# Altium project EE209_Prototype_SMT.PrjPcb
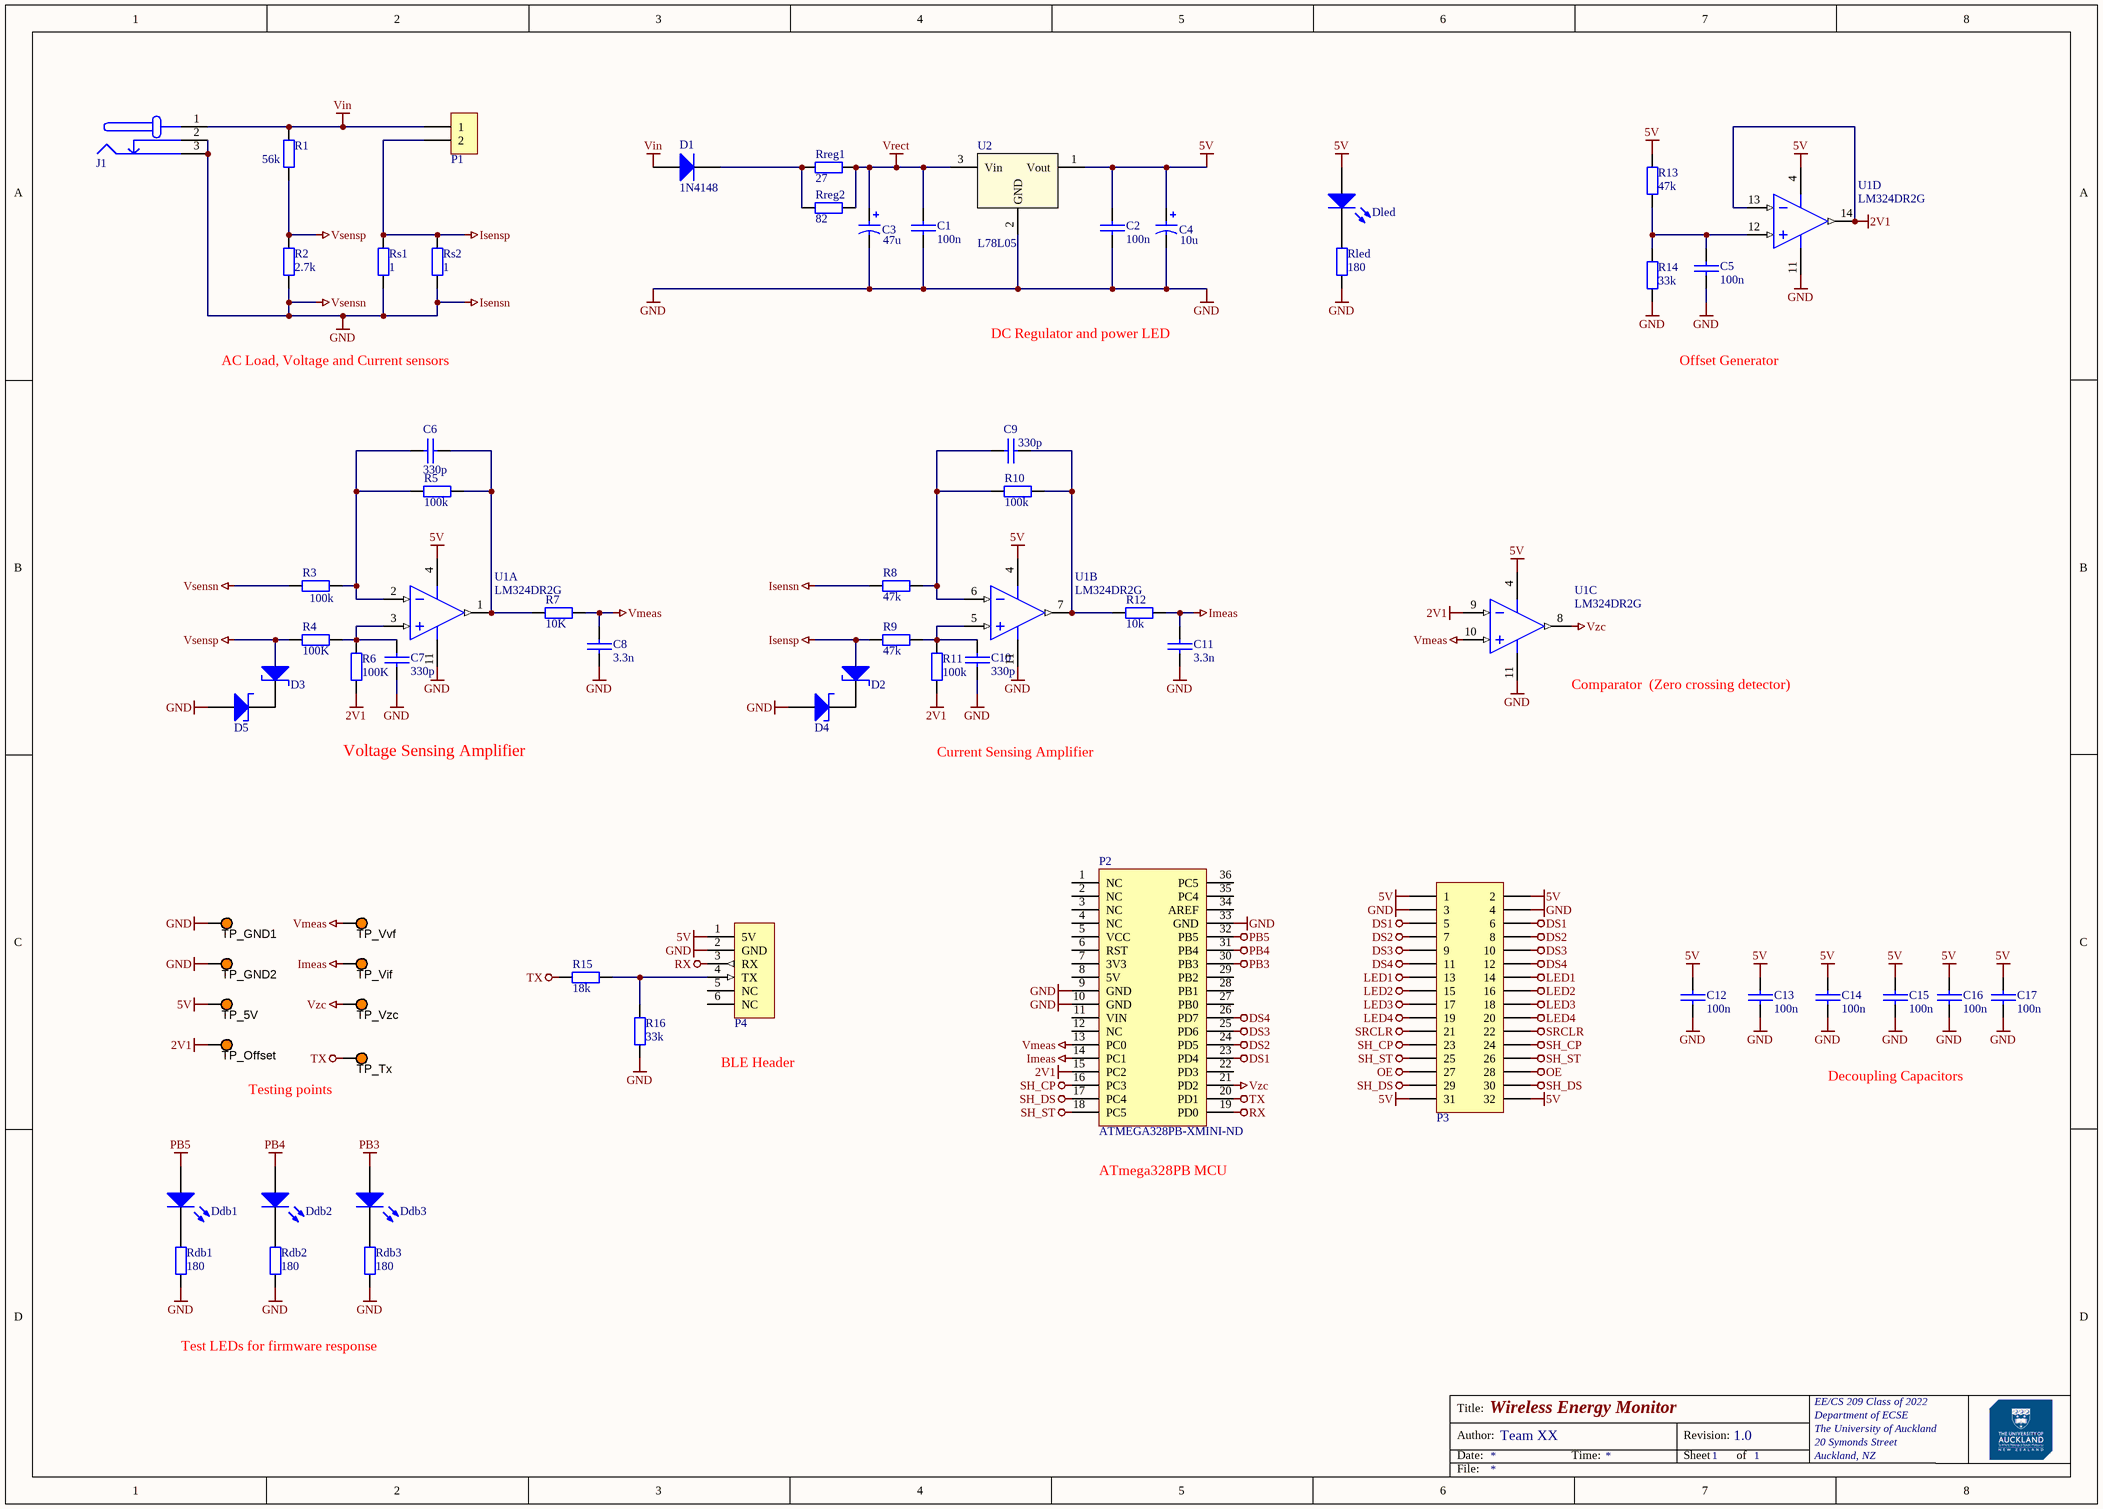
[diagram p0: EE209_Schematic_SMT.SchDoc]
1 sheet, 65 parts. Net scope: global (net labels, ports and power ports of the same name join across sheets).
Board file: SMT_PCB.PcbDoc

## Sheet EE209_Schematic_SMT.SchDoc: Wireless Energy Monitor
size A3; Author: Team XX; Organization: EE/CS 209 Class of 2022; Address1: Department of ECSE; Address2: The University of Auckland; Address3: 20 Symonds Street; Address4: Auckland, NZ; Revision: 1.0; SheetNumber: 1; SheetTotal: 1

### Parts
C1  100n  [0805 CAP]
C2  100n  [0805 CAP]
C3  47u  [CAP POL 8x5.4mm SMT]
C4  10u  [CAP POL 8x5.4mm SMT]
C5  100n  [0805 CAP]
C6  330p  [0805 CAP]
C7  330p  [0805 CAP]
C8  3.3n  [0805 CAP]
C9  330p  [0805 CAP]
C10  330p  [0805 CAP]
C11  3.3n  [0805 CAP]
C12  100n  [0805 CAP]
C13  100n  [0805 CAP]
C14  100n  [0805 CAP]
C15  100n  [0805 CAP]
C16  100n  [0805 CAP]
C17  100n  [0805 CAP]
D1  1N4148  [DO214-MFG]
D2  BZT52H-B4V7  [SOD123]  (value not drawn)
D3  BZT52H-B4V7  [SOD123]  (value not drawn)
D4  BZT52H-B4V7  [SOD123]  (value not drawn)
D5  BZT52H-B4V7  [SOD123]  (value not drawn)
Ddb1  LTST-C170KGKT  [0805 LED]  (value not drawn)
Ddb2  LTST-C170KGKT  [0805 LED]  (value not drawn)
Ddb3  LTST-C170KGKT  [0805 LED]  (value not drawn)
Dled  LTST-C170KGKT  [0805 LED]  (value not drawn)
J1  DC barrel jack  [AC-Socket]  (value not drawn)
P1  Dual Banana Plugs  [Dual Banana Plug]  (value not drawn)
P2  Supplier Part Number 1: ATMEGA328PB-XMINI-ND  [ATmeg328P Xplained]  (hidden comment: ATmega328PB Xplained Mini Header)
P3  Display  [Display]  (value not drawn)
P4  BLE Module Header  [HM10_HDR1X6]  (value not drawn)
R1  value 56k  [0805 RES]
R2  2.7k  [0805 RES]
R3  value 100k  [0805 RES]
R4  100K  [0805 RES]
R5  100k  [0805 RES]
R6  100K  [0805 RES]
R7  10K  [0805 RES]
R8  47k  [0805 RES]
R9  47k  [0805 RES]
R10  100k  [0805 RES]
R11  100k  [0805 RES]
R12  10k  [0805 RES]
R13  47k  [0805 RES]
R14  33k  [0805 RES]
R15  18k  [0805 RES]
R16  33k  [0805 RES]
Rdb1  180  [0805 RES]
Rdb2  180  [0805 RES]
Rdb3  180  [0805 RES]
Rled  180  [0805 RES]
Rreg1  27  [0805 RES]
Rreg2  82  [0805 RES]
Rs1  1  [0805 RES]
Rs2  1  [0805 RES]
TP_5V  5003  [TP_TH]  (value not drawn)
TP_GND1  5003  [TP_TH]  (value not drawn)
TP_GND2  5003  [TP_TH]  (value not drawn)
TP_Offset  5003  [TP_TH]  (value not drawn)
TP_Tx  5003  [TP_TH]  (value not drawn)
TP_Vif  5003  [TP_TH]  (value not drawn)
TP_Vvf  5003  [TP_TH]  (value not drawn)
TP_Vzc  5003  [TP_TH]  (value not drawn)
U1  LM324DR2G  [SOIC-14]  (parts A,B,C,D of 4)
U2  L78L05  [SOT-89]

### Nets
2V1: P2.15(PC2) R6.2 R11.2 TP_Offset.1 U1.9(IN3-) U1.13(IN4-) U1.14(OUT4)
5V: C2.1 C4.1 C12.1 C13.1 C14.1 C15.1 C16.1 C17.1 Dled.1(A) P3.1 P3.2 P3.31 P3.32 P4.1(5V) R13.2 TP_5V.1 U1.4(VCC) U2.1(Vout)
DS1: P2.23(PD4) P3.5 P3.6
DS2: P2.24(PD5) P3.7 P3.8
DS3: P2.25(PD6) P3.9 P3.10
DS4: P2.26(PD7) P3.11 P3.12
GND: C1.2 C2.2 C3.2 C4.2 C5.2 C7.2 C8.2 C10.2 C11.2 C12.2 C13.2 C14.2 C15.2 C16.2 C17.2 D4.1(A) D5.1(A) J1.2(GND_ALT) J1.3(GND) P2.9(GND) P2.10(GND) P2.33(GND) P3.3 P3.4 P4.2(GND) R2.1 R3.1 R8.1 R14.1 R16.1 Rdb1.2 Rdb2.2 Rdb3.2 Rled.1 Rs1.1 Rs2.1 TP_GND1.1 TP_GND2.1 U1.11(VEE/GND) U2.2(GND)  [also labelled Isensn, Vsensn]
Imeas: C11.1 P2.14(PC1) R12.2 TP_Vif.1
Isensp: D2.1(A) P1.2 R9.1 Rs1.2 Rs2.2
LED1: P3.13 P3.14
LED2: P3.15 P3.16
LED3: P3.17 P3.18
LED4: P3.19 P3.20
OE: P3.27 P3.28
PB3: Ddb3.1(A) P2.30(PB3)
PB4: Ddb2.1(A) P2.31(PB4)
PB5: Ddb1.1(A) P2.32(PB5)
RX: P2.19(PD0) P4.3(RX)
SH_CP: P2.16(PC3) P3.23 P3.24
SH_DS: P2.17(PC4) P3.29 P3.30
SH_ST: P2.18(PC5) P3.25 P3.26
SRCLR: P3.21 P3.22
TX: P2.20(PD1) R15.1 TP_Tx.1
Vin: D1.1(A) J1.1(VCC) P1.1 R1.2
Vmeas: C8.1 P2.13(PC0) R7.2 TP_Vvf.1 U1.10(IN3+)
Vrect: C1.1 C3.1 Rreg1.2 Rreg2.2 U2.3(Vin)
Vsensp: D3.1(A) R1.1 R2.2 R4.1
Vzc: P2.21(PD2) TP_Vzc.1 U1.8(OUT3)
NetC5_1: C5.1 R13.1 R14.2 U1.12(IN4+)
NetC6_1: C6.1 R3.2 R5.2 U1.2(IN1-)
NetC6_2: C6.2 R5.1 R7.1 U1.1(OUT1)
NetC7_1: C7.1 R4.2 R6.1 U1.3(IN1+)
NetC9_1: C9.1 R8.2 R10.2 U1.6(IN2-)
NetC9_2: C9.2 R10.1 R12.1 U1.7(OUT2)
NetC10_1: C10.1 R9.2 R11.1 U1.5(IN2+)
NetD1_2: D1.2(K) Rreg1.1 Rreg2.1
NetD2_2: D2.2(K) D4.2(K)
NetD3_2: D3.2(K) D5.2(K)
NetDdb1_2: Ddb1.2(K) Rdb1.1
NetDdb2_2: Ddb2.2(K) Rdb2.1
NetDdb3_2: Ddb3.2(K) Rdb3.1
NetDled_2: Dled.2(K) Rled.2
NetP4_4: P4.4(TX) R15.2 R16.2

Not connected (* = marked no-connect by the designer): P2 1(NC) 2(NC) 3(NC) 4(NC) 5(VCC) 6(RST) 7(3V3) 8(5V) 11(VIN) 12(NC) 22(PD3) 27(PB0) 28(PB1) 29(PB2) 34(AREF) 35(PC4) 36(PC5); P4 5(NC) 6(NC)

### Notes on the sheet
- AC Load, Voltage and Current sensors
- DC Regulator and power LED
- Offset Generator
- (near U1) Comparator  (Zero crossing detector)
- Voltage Sensing Amplifier
- Current Sensing Amplifier
- (near TP_Tx) Testing points
- (near P4) BLE Header
- Decoupling Capacitors
- (near P2) ATmega328PB MCU
- Test LEDs for firmware response
- Title:
- Author:
- Date:
- Time:
- Revision:
- Sheet
- of
- File:

### Library data of the parts
C1 C2 C5-C17 = CerCap_SMT_0805: SMT ceramic capacitor 0805 size
  C1 C2 C5 C12-C17: Value: 100n
  C6 C7 C9 C10: Value: 330p
  C8 C11: Value: 3.3n
C3 C4 = ElecCap_SMT_8D0: CAP ALUM 22UF 20% 50V SMD (Model: UWX1H220MCL1GB); Manufacturer: Nichicon; Manufacturer Part Number: UWX1V220MCL1GB; Lifetime @ Temp.: 2000 Hrs @ 85°C; Polarization: Polar; Surface Mount Land Size: 0.260" L x 0.260" W (6.60mm x 6.60mm); Capacitance 1: 22 µF; Revision: July-2002: Re-released for DXP Platform.; RoHS: RoHS Compliant; Category: Capacitors; Stock 1: 680; Pricing 1: 1=0.59, 10=0.406, 100=0.2304, 500=0.16268 (NZD); Packaging: Cut Tape (CT); Part Status: Active; Tolerance: ±20%; ESR (Equivalent Series Resistance): -; Operating Temperature: -40°C ~ 85°C; Ratings: -; Applications: General Purpose; Lead Spacing: -; Size / Dimension: 0.248" Dia (6.30mm); Height - Seated (Max): 0.213" (5.40mm); Mounting Type: Surface Mount; Package / Case: Radial, Can - SMD; ComponentLink1URL: http://nichicon-us.com/english/products/pdfs/e-uwx.pdf; ComponentLink1Description: http://nichicon-us.com/english/products/pdfs/e-uwx.pdf; Supplier 1: Digi-Key; Supplier Part Number 1: 493-2136-1-ND
  C3: Value: 47u
  C4: Value: 10u
D1 = ES1H_SMT_DO214: 1N4148 100V 200mA SOD-123 diode; Manufacturer: ON Semiconductor; Manufacturer Part Number: 1N4148TR; Diode Type: Standard; Speed: Small Signal =< 200mA (Io), Any Speed; Capacitance @ Vr, F: 4pF @ 0V, 1MHz; Supplier 1: Digi-Key; RoHS: RoHS Compliant; Category: Discrete Semiconductor Products; Stock 1: 1658049; Pricing 1: 1=0.16, 10=0.109, 100=0.0592, 500=0.03648, 1000=0.02488 (NZD); Part Status: Active; Current - Average Rectified (Io): 200mA; Mounting Type: Through Hole; Package / Case: DO-204AH, DO-35, Axial; Supplier Device Package: DO-35; Operating Temperature - Junction: -65°C ~ 175°C; Base Part Number: 1N4148; ComponentLink1URL: https://www.fairchildsemi.com/datasheets/1N/1N914.pdf; ComponentLink1Description: https://www.fairchildsemi.com/datasheets/1N/1N914.pdf; Supplier Part Number 1: 1N4148FSCT-ND
D2-D5 = Zener_SMT_SOD123: SMT zener diode with SOD123 package; Manufacturer: Nexperia USA Inc.; Manufacturer Part Number: BZT52H-B4V7,115; Tolerance: ±2%; Supplier 1: Digi-Key; RoHS: RoHS Compliant; Category: Discrete Semiconductor Products; Stock 1: 0; Pricing 1: 1=0.51, 10=0.408, 100=0.2164, 500=0.14232, 1000=0.09678 (NZD); Packaging: Cut Tape (CT); Part Status: Active; Operating Temperature: -65°C ~ 150°C (TA); Mounting Type: Surface Mount; Package / Case: SOD-123F; Supplier Device Package: SOD-123F; ComponentLink1URL: https://assets.nexperia.com/documents/data-sheet/BZT52H_SER.pdf; ComponentLink1Description: https://assets.nexperia.com/documents/data-sheet/BZT52H_SER.pdf; Supplier Part Number 1: 1727-1611-1-ND
Ddb1-Ddb3 Dled = LED_SMT_0805: SMT LED 0805 size; Manufacturer: Lite-On Inc.; Lens Color: Colorless; Lens Transparency: Clear; Millicandela Rating: 35mcd; Lens Style/Size: Rectangle with Flat Top, 1.40mm x 1.25mm; Voltage - Forward (Vf) (Typ): 2V; Current - Test: 20mA; Viewing Angle: 130°; Wavelength - Dominant: 571nm; Wavelength - Peak: 574nm; Supplier 1: Digi-Key; Manufacturer Part Number: LTST-C170KGKT; RoHS: RoHS Compliant; Category: Optoelectronics; Stock 1: 503069; Pricing 1: 1=0.62, 10=0.459, 25=0.338, 100=0.2415, 250=0.16416, 500=0.14486, 1000=0.11347 (NZD); Packaging: Cut Tape (CT); Part Status: Active; Color: Green; Mounting Type: Surface Mount; Features: -; Package / Case: 0805 (2012 Metric); Size / Dimension: 2.00mm L x 1.25mm W; Height (Max): 1.10mm; ComponentLink1URL: http://optoelectronics.liteon.com/upload/download/DS22-2000-073/LTST-C170KGKT.pdf; ComponentLink1Description: http://optoelectronics.liteon.com/upload/download/DS22-2000-073/LTST-C170KGKT.pdf; Supplier Part Number 1: 160-1414-1-ND
J1 = AC_Input: DC barrel jack connection to AC source; Value: socket
P1 = AC_Output: Dual banana plugs connection to the AC load; LatestRevisionDate: 17-Jul-2002; LatestRevisionNote: Re-released for DXP Platform.; Publisher: Altium Limited
P2 = ATmega328PBXplained_TH: Dual 18-pin headers connecting to ATmega328PB Xplained Mini; Manufacturer: Microchip Technology; Manufacturer Part Number: ATMEGA328PB-XMINI; Board Type: Evaluation Platform; Core Processor: AVR; Platform: ATmega328P Xplained Mini; Contents: Board(s); Supplier 1: Digi-Key; RoHS: RoHS Compliant; Category: Development Boards, Kits, Programmers; Stock 1: 454; Pricing 1: 1=15.11 (NZD); Part Status: Active; Type: MCU 8-Bit; Operating System: -; For Use With/Related Products: ATmega328P; Mounting Type: Fixed; ComponentLink1URL: http://www.microchip.com/mymicrochip/filehandler.aspx?ddocname=en589665; ComponentLink1Description: http://www.microchip.com/mymicrochip/filehandler.aspx?ddocname=en589665
P3 = Display: 16-Pin Header Connecting Display
P4 = BLEModule_TH: 2.54mm pitch 6-pin header for BLE module; LatestRevisionDate: 17-Jul-2002; LatestRevisionNote: Re-released for DXP Platform.; Publisher: Altium Limited
R1-R16 Rdb1-Rdb3 Rled Rreg1 Rreg2 Rs1 Rs2 = Res_SMT_0805: 0805 resistor; Published: 8-Jun-2000; LatestRevisionDate: 17-Jul-2002; LatestRevisionNote: Re-released for DXP Platform.; PackageReference: AXIAL-0.4; Publisher: Altium Limited; ComponentLink1Description: https://nz.mouser.com/datasheet/2/315/AOA0000C304-1149620.pdf
  R2: Value: 2.7k
  R4 R6: Value: 100K
  R5 R10 R11: Value: 100k
  R7: Value: 10K
  R8 R9 R13: Value: 47k
  R12: Value: 10k
  R14 R16: Value: 33k
  R15: Value: 18k
  Rdb1-Rdb3 Rled: Value: 180
  Rreg1: Value: 27
  Rreg2: Value: 82
  Rs1 Rs2: Value: 1
TP_5V TP_GND1 TP_GND2 TP_Offset TP_Tx TP_Vif TP_Vvf TP_Vzc = TestPoint: Test Point, Orange, 1-Pin THD, RoHS; Peak Reverse Current: 600 uA; Forward Current: 3 A; Max Surge Current: 80 A; Forward Voltage: 1.08 V; Max Operating Temperature: 150 degC; PackageReference: 5003; Pins: 2; ComponentLink2URL: http://keyelco.com/userAssets/file/M65p56.pdf; PackageDescription: 1-Pin Through Hole Device, Dia 2.54 mm; Weight: 0.01 lb; Diameter: 5.3 mm; Mount: Through Hole; Package Quantity: 500; Packaging: Bulk; Min Operating Temperature: -65 degC; ComponentLink1Description: Manufacturer URL; Height: 0.25 inch; ComponentLink1URL: http://www.keyelco.com/; ComponentLink2Description: Datasheet; Width: 0.25 inch; REACH SVHC: No SVHC; RoHSCompliant: true; Radiation Hardening: No; Length: 9.5 mm; DatasheetVersion: Jun-15
U1 = LM324DR_SMT_SOIC16: Single Supply Quad Operational Amplifier, 3 to 32 V, 0 to 70 degC, 14-Pin SOIC, Pb-Free, Tape and Reel; Manufacturer: On Semiconductor; VCC Max (V): 32; VCC Min (V): 3; PackageVersion: Rev. K, 05/2011; ComponentLink3URL: http://www.onsemi.com/pub_link/Collateral/751A-03.PDF; ComponentLink3Description: Package Specification; Packing: Tape and Reel; ComponentLink2URL: http://www.onsemi.cn/pub_link/Collateral/LM324-D.PDF; PackageReference: SOIC-14-751A-03; ComponentLink1URL: http://www.onsemi.com/; PackageDescription: 14-Pin Small Outline Integrated Circuit, Body 8.65 x 3.9 mm, Pitch 1.27 mm; ComponentLink1Description: Manufacturer URL; DatasheetVersion: Rev. 25; Mounting Technology: Surface Mount; RoHS: TRUE; ComponentLink2Description: Datasheet; PartNumber: LM324DR2G
U2 = L78L05_SMT_SOT89: LDO Voltage Regulator 5V; ComponentLink1URL: http://www.st.com/content/ccc/resource/technical/document/datasheet/99/3b/7d/91/91/51/4b/be/CD00000544.pdf/files/CD00000544.pdf/jcr:content/translations/en.CD00000544.pdf; ComponentLink1Description: http://www.st.com/content/ccc/resource/technical/document/datasheet/99/3b/7d/91/91/51/4b/be/CD00000544.pdf/files/CD00000544.pdf/jcr:content/translations/en.CD00000544.pdf; Supplier 1: Digi-Key; Supplier Part Number 1: 497-1181-1-ND